# Altium schematic sheet top.SchDoc: TOP
size A4; Organization: Altium Limited; Address1: L3, 12a Rodborough Rd; Address2: Frenchs Forest; Address3: NSW; Address4: Australia 2086; Revision: 1.0
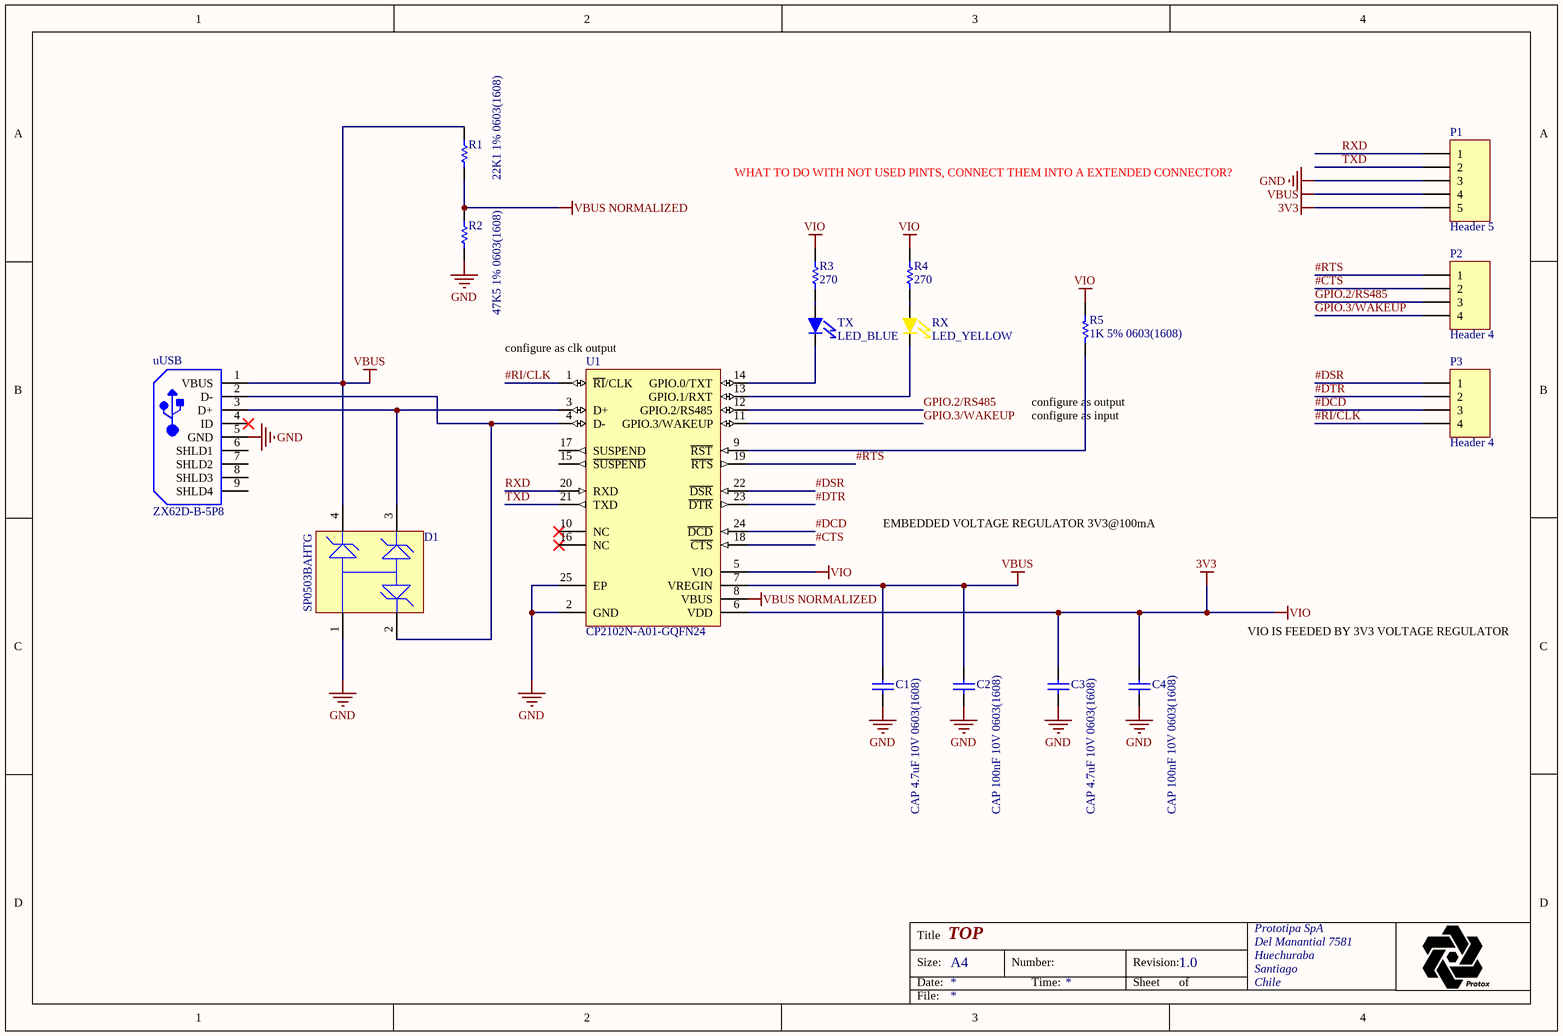
[diagram p0: top.SchDoc]

## Parts
C1  CAP 4.7uF 10V 0603(1608)  [CAPC0603(1608)100_M]
C2  CAP 100nF 10V 0603(1608)  [CAPC0603(1608)100_N]
C3  CAP 4.7uF 10V 0603(1608)  [CAPC0603(1608)100_M]
C4  CAP 100nF 10V 0603(1608)  [CAPC0603(1608)100_N]
D1  SP0503BAHTG  [LFUS-SOT143-4_V]
P1  Header 5  [HDR1X5]
P2  Header 4  [HDR1X4]
P3  Header 4  [HDR1X4]
R1  22K1 1% 0603(1608)  [RESC0603(1608)_N]
R2  47K5 1% 0603(1608)  [RESC0603(1608)_N]
R3  270  [RES0603]
R4  270  [RES0603]
R5  1K 5% 0603(1608)  [RESC0603(1608)_L]
RX  LED_YELLOW  [LED0603]
TX  LED_BLUE  [LED0603]
U1  CP2102N-A01-GQFN24  [SLAB-QFN-24-2550x2550TP_A_V]
uUSB  ZX62D-B-5P8  [HIRO-ZX62D-B-5P8_V]

## Nets
3V3: C3.2 C4.2 P1.5 R3.2 R4.2 R5.2 U1.5(VIO) U1.6(VDD)  [also labelled VIO]
GND: C1.1 C2.1 C3.1 C4.1 D1.1 P1.3 R2.1 U1.2(GND) U1.25(EP) uUSB.5(GND)
VBUS: C1.2 C2.2 D1.4 P1.4 R1.2 U1.7(VREGIN) uUSB.1(VBUS)
VBUS NORMALIZED: R1.1 R2.2 U1.8(VBUS)
#CTS: P2.2 U1.18(~{CTS})
#DCD: P3.3 U1.24(~{DCD})
#DSR: P3.1 U1.22(~{DSR})
#DTR: P3.2 U1.23(~{DTR})
#RI/CLK: P3.4 U1.1(~{RI}/CLK)
#RTS: P2.1 U1.19(~{RTS})
GPIO.2/RS485: P2.3 U1.12(GPIO.2/RS485)
GPIO.3/WAKEUP: P2.4 U1.11(GPIO.3/WAKEUP)
RXD: P1.1 U1.20(RXD)
TXD: P1.2 U1.21(TXD)
NetD1_2: D1.2 U1.4(D-) uUSB.2(D-)
NetD1_3: D1.3 U1.3(D+) uUSB.3(D+)
NetR3_1: R3.1 TX.A
NetR4_1: R4.1 RX.A
NetR5_1: R5.1 U1.9(~{RST})
NetRX_K: RX.K U1.13(GPIO.1/RXT)
NetTX_K: TX.K U1.14(GPIO.0/TXT)

Not connected (* = marked no-connect by the designer): U1 10(NC)* 15(~{SUSPEND}) 16(NC)* 17(SUSPEND); uUSB 4(ID)* 6(SHLD1) 7(SHLD2) 8(SHLD3) 9(SHLD4)

## Notes on the sheet
- WHAT TO DO WITH NOT USED PINTS, CONNECT THEM INTO A EXTENDED CONNECTOR?
- (near U1) configure as clk output
- configure as output
- configure as input
- EMBEDDED VOLTAGE REGULATOR 3V3@100mA
- VIO IS FEEDED BY 3V3 VOLTAGE REGULATOR
- Title
- Size:
- Date:
- A4
- Number:
- Time:
- Revision:
- Sheet
- of
- Prototipa SpA
- Del Manantial 7581
- Huechuraba
- Santiago
- Chile
- File:

## Library data of the parts
C1 C3 = CMP-1035-02787-1: CAP 4.7uF 10V ±20% 0603 (1608 Metric) Thickness 1mm SMD; Case-EIA: 0603; Case-Metric: 1608; Tolerance: Â±20%; Value: 4.7uF; Max Thickness: 1 mm; Technology: SMT; Rated Voltage: 10 V
C2 C4 = CMP-1035-02581-1: CAP 100nF 10V ±20% 0603 (1608 Metric) Thickness 1mm SMD; Tolerance: Â±20%; Case-Metric: 1608; Case-EIA: 0603; Max Thickness: 1 mm; Rated Voltage: 10 V; Technology: SMT; Value: 100nF
D1 = CMP-2000-05191-1: TVS Diode Array, 30 pF, 30 KV, -40 to 85 degC, 4-Pin SOT143, RoHS, Tape and Reel; Manufacturer: Littelfuse; Direction Type: Uni-Directional; Product Height (mm): 1.05mm; Leakage Current (Max): 0.1uA; Clamping Voltage (Max): 8V; Reverse Stand-off Voltage: 5.5(Min)V; Configuration: Triple; Working Voltage: 5.5V; Product Length (mm): 3.04mm; Working Voltage (Max): 5.5V(Min); Capacitance Value: 30pF; Rad Hardened: No; Number of Elements: 3; Product Depth (mm): 1.4mm; Operating Temperature Max Deg. C: 85C; Suppressor Type: TVS; Operating Temperature Min Deg. C: -40C; Operating Temp Range: -40Cto85C; Mounting: SurfaceMount; Package / Case: SOT-143; Datasheet Version: Dec-13; Package Type: SOT-143; Packaging: TapeandReel; Pin Count: 3+Tab; Operating Temperature Classification: Industrial; Datasheet URL: https://datasheet.ciiva.com/15143/getdatasheetpartid-116020-15143550.pdf; Manufacturer URL: http://www.littelfuse.com/; Leakage Current: 0.1uA; Mounting Style: SurfaceMount; Clamping Voltage: 8V; Polarity: Uni-Directional
P1 = Header 5: Header, 5-Pin; LatestRevisionDate: 17-Jul-2002; LatestRevisionNote: Re-released for DXP Platform.; Publisher: Altium Limited
P2 P3 = Header 4: Header, 4-Pin; LatestRevisionDate: 17-Jul-2002; LatestRevisionNote: Re-released for DXP Platform.; Publisher: Altium Limited
R1 = CMP-1012-00660-1: 22K1 0.1W 1% 0603 (1608 Metric)  SMD; Case-EIA: 0603; Case-Metric: 1608; Value: 22100.00 Ohm; Tolerance: 1 %; Power: 0.1 W; Technology: SMT
R2 = CMP-1012-00700-1: 47K5 0.1W 1% 0603 (1608 Metric)  SMD; Value: 47500.00 Ohm; Case-Metric: 1608; Case-EIA: 0603; Tolerance: 1 %; Power: 0.1 W; Technology: SMT
R3 R4 = 21: id: 21; tolerance: 1%; solutionId: 87; package: '0603'; value: 270
R5 = CMP-1012-00074-1: 1K 0.1W 5% 0603 (1608 Metric)  SMD; Case-EIA: 0603; Case-Metric: 1608; Value: 1000.00 Ohm; Technology: SMT; Tolerance: 5 %; Power: 0.1 W
RX = 7: =description; part number: LED YELLOW; id: 7; solutionId: 35; type: led
TX = 6: =description; part number: LED BLUE; id: 6; solutionId: 34; type: led
U1 = CMP-2000-07570-1: USBXpress(TM) Family, 4 GPIOs, 2.2 to 3.6 V, -40 to 85 degC, 24-Pin QFN, RoHS; Manufacturer: Silicon Labs; Max Supply Voltage: 3.6V; Min Supply Voltage: 3V; Datasheet Version: Rev. 1.1, 08/2016; Max Operating Temperature: 85degC; Case\/Package: QFN; Number of Pins: 24; Min Operating Temperature: -40degC; Mounting Technology: SurfaceMount; Manufacturer URL: http://www.silabs.com/; RoHSCompliant: False; Package Reference: QFN-24-2550x2550TP_A; Datasheet URL: http://www.silabs.com/documents/public/data-sheets/cp2102n-datasheet.pdf; Package Description: 24-Pin Quad Flat No-lead Package, Body 4 x 4 mm, Pitch 0.5 mm; REACH SVHC: Unknown
uUSB = CMP-0029-00002-1: Right Angle Receptacle Connector, Micro USB, 30 V(AC), -30 to 85 degC, 5-Pin SMD, RoHS, Tape and Reel; Capacitance: 1 uF; Tolerance: 10%; ESR: 7.5 Ohm; Voltage Rating: 35 V; PackageDescription: USB Connector, 5 Position Surface Mount, Length 8 mm, Height 2.65 mm; DatasheetVersion: Aug-16; REACH SVHC: No SVHC; Package Quantity: 2000; ComponentLink1Description: Manufacturer URL; ComponentLink2URL: https://www.hirose.com/product/en/download_file/key_name/ZX62D-B-5P8/category/Catalog/doc_file_id/31704/?file_category_id=5&item_id=02420034000&is_series=; Length: 3.2 mm; ComponentLink1URL: https://www.hirose.com; Radiation Hardening: No; Height: 1.8 mm; Max Operating Temperature: 125degC; Weight: 0.000571 oz; Min Operating Temperature: -55degC; ComponentLink3Description: Package Specification; Width: 1.6 mm; Case Code (Metric): 3216; Mount: Surface Mount; ComponentLink2Description: Datasheet; Case Code (Imperial): 1206; ComponentLink3URL: https://www.hirose.com/product/en/download_file/key_name/ZX62D-B-5P8/category/Drawing%20(2D)/doc_file_id/36535/?file_category_id=6&item_id=02420034000&is_series=; Pins: 2; Resistance: 7.5 Ohm; Packaging: Tape and Reel; RoHSCompliant: True; Voltage Rating (DC): 35 V; Case/Package: 1206; PackageReference: ZX62D-B-5P8